# EasyEDA Pro project v1_full_project.epro, board PCB2_3
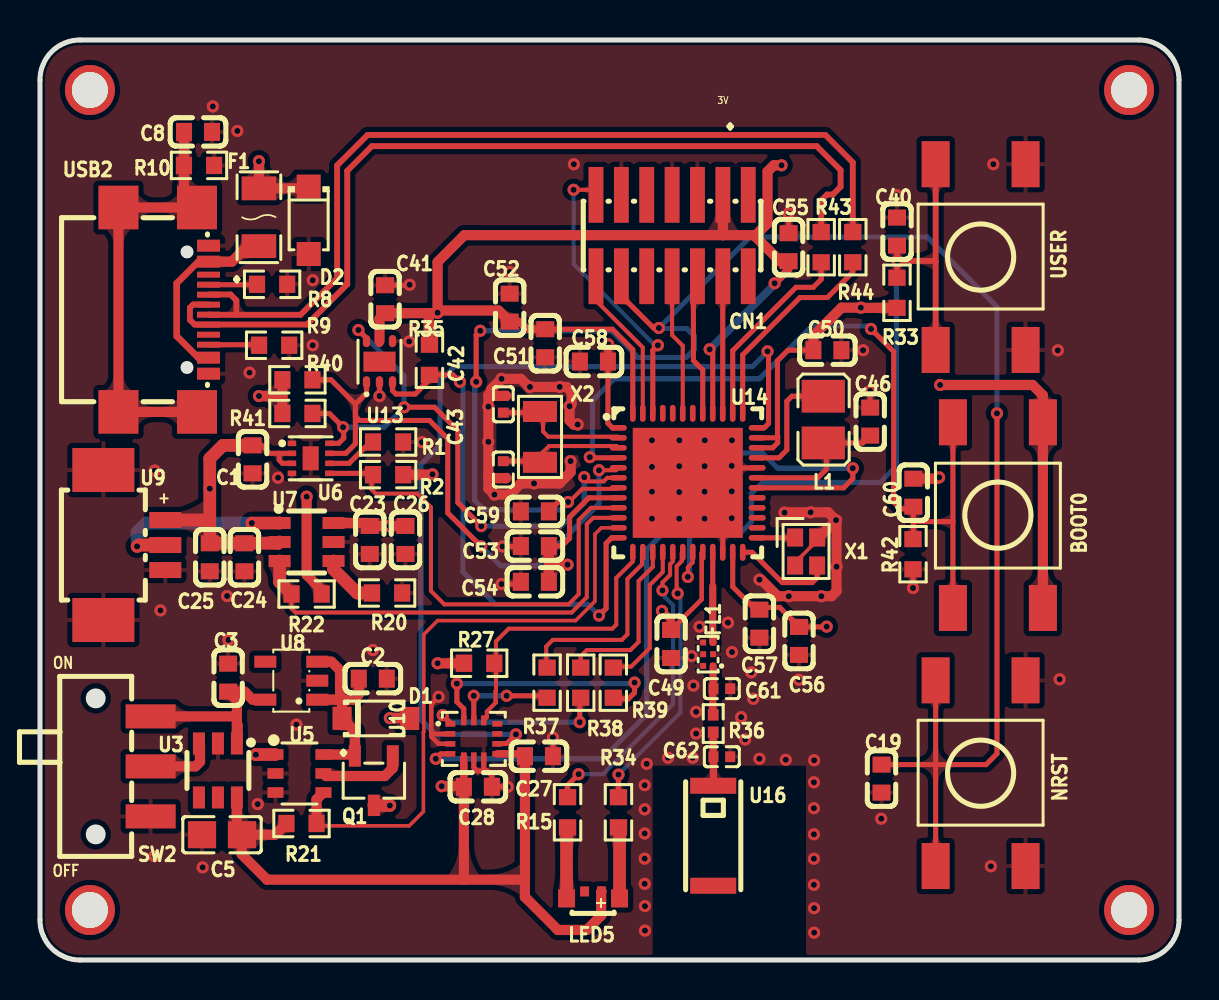
[diagram p1: board, top side]
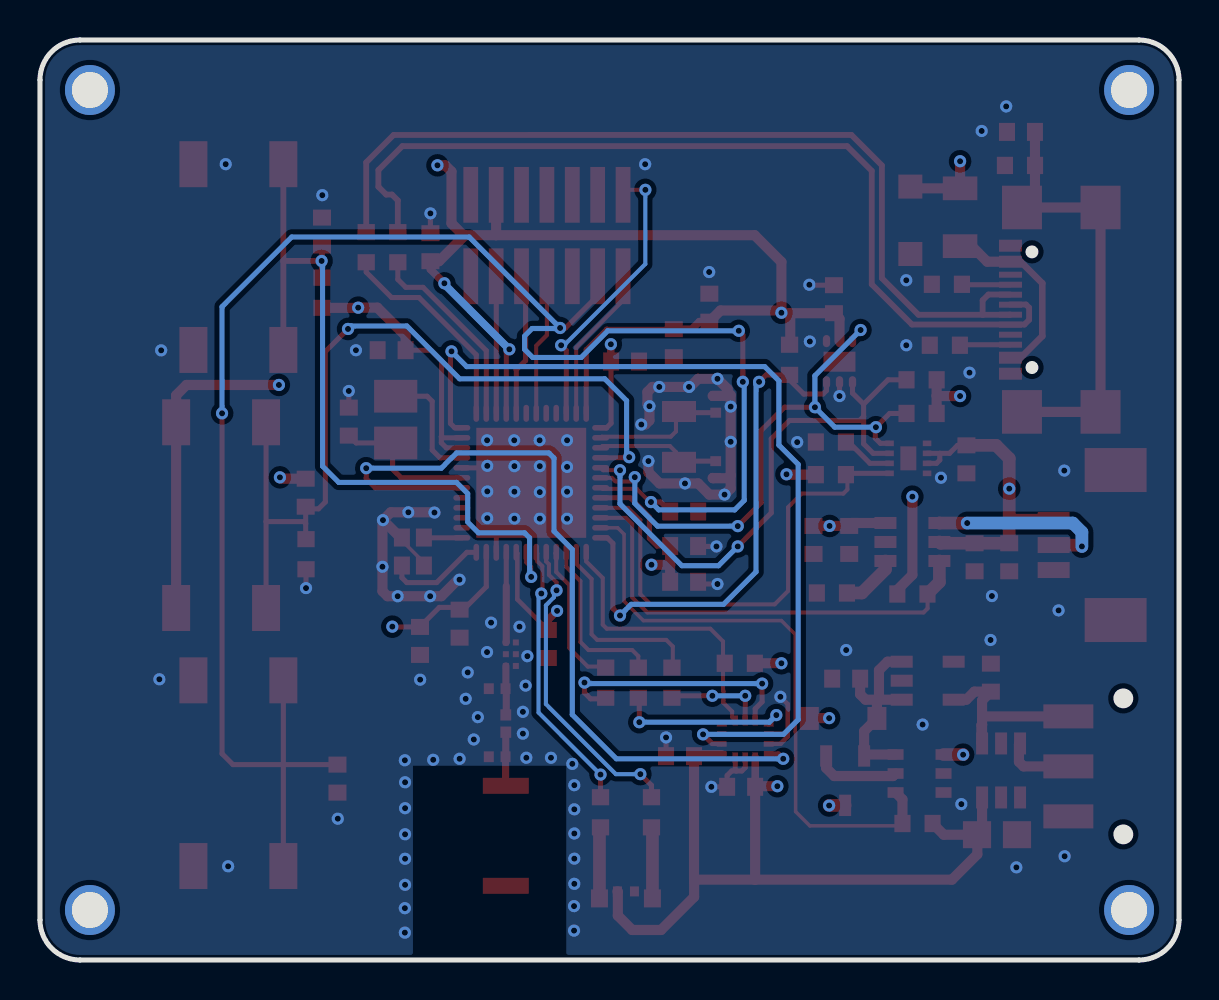
[diagram p2: board, bottom side, seen from below]

Outline 57 x 46 mm; copper layers: Top Layer, GND, POWER, Bottom Layer. Coordinates in mm from the lower left corner of the outline.
Outline path: 0,44 0,2 arc(0.59,0.59) 2,0 55,0 arc(56.41,0.59) 57,2 57,44 arc(56.41,45.41) 55,46 2,46 arc(0.59,45.41) 0,44
Stack: Top Layer 0.035mm 外层铜厚1oz / Dielectric1 0.2104mm 7628 RC49% 8.6mil / GND 0.0152mm 内层铜厚 / Dielectric2 1.065mm 1.1mm H/HOZ Copper / POWER 0.0152mm 内层铜厚 / Dielectric3 0.2104mm 7628 RC49% 8.6mil / Bottom Layer 0.035mm 外层铜厚1oz

## Design rules (mm)
net USBP: DP1
net USBN: DP1
spacing copperThickness1oz (default): track to track 0.102, other pairs 0.102 to 0.3
spacing copperThickness2oz: track to track 0.051, other pairs 0.051 to 0.3
spacing Plane_innerPlane: track to track 0.102, other pairs 0.102 to 0.3
spacing Copper_copperRegion: track to track 0.102, other pairs 0.102 to 0.3
track width copperThickness1oz (default): min 0.089, default 0.254, max 2.54
track width copperThickness2oz: min 0.051, default 0.254, max 2.54
differential pair differentialPair (default): width min 0.127, default 0.292, max 2.54; gap min 0.152, default 0.152
via viaSize (default): diameter min 0.5, default 0.61, max 10; hole min 0.3, default 0.305, max 6.3
net GND uses copperRegion_copperThickness1oz
pour e849 uses Copper_copperRegion, copperRegion_Copper_copperRegion
pour e1013 uses Copper_copperRegion, copperRegion_Copper_copperRegion
pour e1015 uses Copper_copperRegion, copperRegion_Copper_copperRegion
pour e1136 uses Copper_copperRegion, copperRegion_Copper_copperRegion

## Placement (name value [footprint] x y rotation side)
BOOT0  TL3301AF160QG  [KEY-SMD_4P-L6.0-W6.0-P4.50-LS10.0]  47.94 22.24 0 top
C1  100nF  [C0603]  10.64 25.03 90 top
C2  1uF  [C0603]  16.66 14.07 0 top
C3  1uF  [C0603]  9.42 14.12 90 top
C5  47uF  [C0805]  9.11 6.26 180 top
C8  100nF  [C0603]  7.91 41.41 0 top
C19  1uF  [C0603]  42.11 9.07 270 top
C23  4.7uF  [C0603]  16.5 21 270 top
C24  4.7uF  [C0603]  10.23 20.14 270 top
C25  100nF  [C0603]  8.5 20.14 90 top
C26  100nF  [C0603]  18.29 21 90 top
C27  100nF  [C0603]  24.97 10.19 180 top
C28  100nF  [C0603]  21.91 8.66 180 top
C40  1uF  [C0603]  42.89 36.42 90 top
C41  100nF  [C0603]  17.27 33.04 90 top
C42  8.2pF  [C0402]  23.19 27.79 90 top
C43  8.2pF  [C0402]  23.19 24.52 270 top
C46  4.7uF  [C0603]  41.55 26.92 90 top
C49  100nF  [C0603]  31.58 15.8 90 top
C50  100nF  [C0603]  39.4 30.49 0 top
C51  100nF  [C0603]  25.28 30.84 270 top
C52  4.7uF  [C0603]  23.5 32.62 90 top
C53  10nF  [C0603]  24.77 20.7 180 top
C54  1uF  [C0603]  24.77 18.91 180 top
C55  100nF  [C0603]  37.46 35.64 90 top
C56  100nF  [C0603]  37.98 15.95 90 top
C57  100pF  [C0603]  36 16.82 90 top
C58  100nF  [C0603]  27.72 29.92 0 top
C59  100nF  [C0603]  24.77 22.43 180 top
C60  1uF  [C0603]  43.7 23.37 270 top
C61  8.2pF  [C0402]  34.12 13.57 0 top
C62  8.2pF  [C0402]  34.12 10.16 0 top
CN1  FTSH-107-01-L-DV-K  [HDR-SMD_14P-P1.27_FTSH-107-01-L-DV-K]  31.63 36.22 180 top
D1  B5819W-TP  [SOD-123_L2.8-W1.8-LS3.7-RD]  16.81 12.08 0 top
D2  SMF5V0A-E3-08  [SMF_L2.8-W1.8-LS3.7-RD]  13.45 36.98 270 top
F1  MF-NSMF050-2  [F1206]  10.96 37.14 270 top
FL1  MLPF-WB55-02E3  [FILTER-SMD_6P-L1.6-W1.0-P0.50-BL]  33.43 15.29 90 top
L1  2.2uH  [L1008]  39.2 27.02 270 top
LED5  APFA2507B2Y2C  [LED-SMD_4P-L2.5-W1.0_APFA2507LQBDSEEZGKC]  27.68 3.25 180 top
NOREF  -  [Pad_e11400]  2.5 2.5 0 top
NOREF#2  -  [Pad_e10787]  2.5 43.5 0 top
NOREF#3  -  [Pad_e11401]  54.5 43.5 0 top
NOREF#4  -  [Pad_e11402]  54.5 2.5 0 top
NRST  TL3301AF160QG  [KEY-SMD_4P-L6.0-W6.0-P4.50-LS10.0]  47.07 9.34 180 top
Q1  AO3407A  [SOT-23-3_L2.9-W1.6-P1.90-LS2.8-BR]  16.71 8.97 90 top
R1  10kΩ  [R0603]  17.42 25.9 180 top
R2  100kΩ  [R0603]  17.42 24.27 180 top
R8  5.1kΩ  [R0603]  11.62 33.79 180 top
R9  5.1kΩ  [R0603]  11.72 30.74 180 top
R10  10kΩ  [R0603]  7.96 39.73 0 top
R15  4.7kΩ  [R0603]  26.4 7.39 270 top
R20  1.8kΩ  [R0603]  17.37 18.35 0 top
R21  470kΩ  [R0603]  13.09 6.83 180 top
R22  100kΩ  [R0603]  13.34 18.3 0 top
R27  10kΩ  [R0603]  21.98 14.84 180 top
R33  10kΩ  [R0603]  42.89 33.36 270 top
R34  4.7kΩ  [R0603]  28.95 7.39 270 top
R35  5kΩ  [R0603]  19.49 30.01 90 top
R36  0Ω  [R0402]  33.69 11.82 270 top
R37  22Ω  [R0603]  25.38 13.87 90 top
R38  22Ω  [R0603]  27.06 13.87 90 top
R39  22Ω  [R0603]  28.69 13.87 90 top
R40  4.7kΩ  [R0603]  12.88 29.01 0 top
R41  4.7kΩ  [R0603]  12.88 27.33 0 top
R42  10kΩ  [R0603]  43.69 20.29 90 top
R43  22Ω  [R0603]  39.09 35.64 90 top
R44  22Ω  [R0603]  40.67 35.64 90 top
SW2  JS102011SAQN  [SW-SMD_JS102011SAQN]  5.54 9.68 270 top
U3  TPS22917DBVR  [SOT-23-6_L2.9-W1.6-P0.95-LS2.8-BR]  8.9 9.48 90 top
U5  LTC4412ES6#TRPBF  [TSOT-23-6_L2.9-W1.6-P0.95-LS2.8-BR]  12.98 9.32 180 top
U6  MAX17048G+T10  [TDFN-8_L2.0-W2.0-P0.50-BL-EP1.2]  13.55 25.08 270 top
U7  BQ21040DBVT  [SOT-23-6_L2.9-W1.6-P0.95-LS2.8-BR]  13.34 20.9 180 top
U8  TLV75530PDBVR  [SOT-23-5_L3.0-W1.7-P0.95-LS2.8-BR]  12.58 13.97 0 top
U9  532610371  [CONN-TH_532610371]  4.72 20.75 270 top
U10  LSM6DSOXTR  [LGA-14L_L3.0-W2.5-P0.50-TL]  21.71 11.06 0 top
U13  TMP117AIDRVR  [WSON-6_L2.0-W2.0-P0.65-TL-EP]  16.99 29.92 90 top
U14  STM32WB55CCU6  [VQFN-48_L7.0-W7.0-P0.50-BL-EP5.5]  32.42 23.86 270 top
U16  2450AT42A100E  [ANT-SMD_L5.0-W2.0]  33.69 6.21 270 top
USB2  USB4110-GF-A  [USB-C-SMD_TYPE-C-16P-USB4110-GF-A]  6.18 32.52 270 top
USER  TL3301AF160QG  [KEY-SMD_4P-L6.0-W6.0-P4.50-LS10.0]  47.07 35.15 180 top
X1  32MHz  [CRYSTAL-SMD_4P-L2.0-W1.6-BL]  38.34 20.42 270 top
X2  32.768kHz  [CRYSTAL-SMD_L3.2-W1.5-2]  25.02 26.15 90 top

## Footprints (pads in the part's own frame, mm; a bottom-side part is the same pattern mirrored in y, then rotated)
ANT-SMD_L5.0-W2.0
  rect 0.8x2.3 smd: 1(-2.5,0) 2(2.5,0)
C0402
  rect 0.5x0.54 smd: 1(-0.42,0) 2(0.42,0)
C0603
  rect 0.8x0.9 smd: 1(-0.7,0) 2(0.7,0)
C0805
  rect 1.41x1.35 smd: 1(-1,0) 2(1,0)
CONN-TH_532610371
  rect 0.8x1.6 smd: 1(-1.25,1.55) 2(0,1.55) 3(1.25,1.55)
  rect 2.2x3.1 smd: 4(3.75,-1.55) 5(-3.75,-1.55)
CRYSTAL-SMD_4P-L2.0-W1.6-BL
  rect 0.9x0.8 smd: 1(-0.7,-0.55) 2(0.7,-0.55) 3(0.7,0.55) 4(-0.7,0.55)
CRYSTAL-SMD_L3.2-W1.5-2
  rect 1.05x1.7 smd: 1(-1.27,0) 2(1.27,0)
F1206
  rect 1.19x1.728 smd: 1(-1.445,0) 2(1.445,0)
FILTER-SMD_6P-L1.6-W1.0-P0.50-BL
  rect 0.3x0.3 smd: 1(-0.587,-0.25) 2(0,-0.25) 3(0.587,-0.25) 4(0.587,0.25) 5(0,0.25) 6(-0.587,0.25)
HDR-SMD_14P-P1.27_FTSH-107-01-L-DV-K
  rect 0.74x2.79 smd: 01(-3.81,-2.035) 02(-3.81,2.035) 03(-2.54,-2.035) 04(-2.54,2.035) 05(-1.27,-2.035) 06(-1.27,2.035) 07(0,-2.035) 08(0,2.035) 09(1.27,-2.035) 10(1.27,2.035) 11(2.54,-2.035) 12(2.54,2.035) 13(3.81,-2.035) 14(3.81,2.035)
KEY-SMD_4P-L6.0-W6.0-P4.50-LS10.0
  rect 1.4x2.3 smd: 1(-2.25,-4.643) 2(-2.25,4.643) 3(2.25,4.643) 4(2.25,-4.643)
L1008
  rect 1.635x2.16 smd: 1(-1.167,0) 2(1.167,0)
LED-SMD_4P-L2.5-W1.0_APFA2507LQBDSEEZGKC
  rect 0.85x0.9 smd: 1(-1.325,0.175) 4(1.325,0.175)
  rect 0.45x0.5 smd: 2(-0.425,-0.175) 3(0.425,-0.175)
LGA-14L_L3.0-W2.5-P0.50-TL
  rect 0.5x0.28 smd: 1(-1.175,0.75) 2(-1.175,0.25) 3(-1.175,-0.25) 4(-1.175,-0.75) 8(1.175,-0.75) 9(1.175,-0.25) 10(1.175,0.25) 11(1.175,0.75)
  rect 0.28x0.5 smd: 5(-0.5,-0.925) 6(0,-0.925) 7(0.5,-0.925) 12(0.5,0.925) 13(0,0.925) 14(-0.5,0.925)
Pad_e10787
  round 2.5 hole 1.8: 1(0,0)
Pad_e11400
  round 2.5 hole 1.8: 1(0,0)
Pad_e11401
  round 2.5 hole 1.8: 1(0,0)
Pad_e11402
  round 2.5 hole 1.8: 1(0,0)
R0402
  rect 0.566x0.54 smd: 1(-0.433,0) 2(0.433,0)
R0603
  rect 0.806x0.864 smd: 1(-0.753,0) 2(0.753,0)
SMF_L2.8-W1.8-LS3.7-RD
  rect 1.2x1.2 smd: 1(-1.685,0) 2(1.685,0)
SOD-123_L2.8-W1.8-LS3.7-RD
  rect 0.95x1.15 smd: 1(-1.692,0) 2(1.692,0)
SOT-23-3_L2.9-W1.6-P1.90-LS2.8-BR
  rect 1.07x0.6 smd: 1(1.235,-0.95) 2(1.235,0.95) 3(-1.235,0)
SOT-23-5_L3.0-W1.7-P0.95-LS2.8-BR
  rect 1.1x0.6 smd: 1(1.3,-0.95) 2(1.3,0) 3(1.3,0.95) 4(-1.3,0.95) 5(-1.3,-0.95)
SOT-23-6_L2.9-W1.6-P0.95-LS2.8-BR
  rect 1.1x0.6 smd: 1(1.35,-0.95) 2(1.35,0) 3(1.35,0.95) 4(-1.35,0.95) 5(-1.35,0) 6(-1.35,-0.95)
SW-SMD_JS102011SAQN
  rect 1.2x2.5 smd: 1(-2.5,0) 2(0,0) 3(2.5,0)
TDFN-8_L2.0-W2.0-P0.50-BL-EP1.2
  rect 0.28x0.425 smd: 1(-0.75,-0.938) 2(-0.25,-0.938) 3(0.25,-0.938) 4(0.75,-0.938) 5(0.75,0.938) 6(0.25,0.938) 7(-0.25,0.938) 8(-0.75,0.938)
  rect 1.2x0.8 smd: 9(0,0)
TSOT-23-6_L2.9-W1.6-P0.95-LS2.8-BR
  rect 0.8x0.532 smd: 1(1.2,-0.95) 2(1.2,0) 3(1.2,0.95) 4(-1.2,0.95) 5(-1.2,0) 6(-1.2,-0.95)
USB-C-SMD_TYPE-C-16P-USB4110-GF-A
  rect 2.18x2 smd: 8(-5.11,1.677) 9(5.11,1.677) 10(-5.11,-2.252) 11(5.11,-2.252)
  rect 0.6x1.15 smd: A1B12(-3.2,2.252) A4B9(-2.4,2.252) B1A12(3.2,2.252) B4A9(2.4,2.252)
  rect 0.3x1.15 smd: A5(-1.25,2.252) A6(-0.25,2.252) A7(0.25,2.252) A8(1.25,2.252) B5(1.75,2.252) B6(0.75,2.252) B7(-0.75,2.252) B8(-1.75,2.252)
VQFN-48_L7.0-W7.0-P0.50-BL-EP5.5
  oval 0.28x0.85 smd: 1(-2.75,-3.474) 2(-2.25,-3.474) 3(-1.75,-3.474) 4(-1.25,-3.474) 5(-0.75,-3.474) 6(-0.25,-3.474) 7(0.25,-3.474) 8(0.75,-3.474) 9(1.25,-3.474) 10(1.75,-3.474) 11(2.25,-3.474) 12(2.75,-3.474) 25(2.75,3.474) 26(2.25,3.474) 27(1.75,3.474) 28(1.25,3.474) 29(0.75,3.474) 30(0.25,3.474) 31(-0.25,3.474) 32(-0.75,3.474) 33(-1.25,3.474) 34(-1.75,3.474) 35(-2.25,3.474) 36(-2.75,3.474)
  oval 0.85x0.28 smd: 13(3.474,-2.75) 14(3.474,-2.25) 15(3.474,-1.75) 16(3.474,-1.25) 17(3.474,-0.75) 18(3.474,-0.25) 19(3.474,0.25) 20(3.474,0.75) 21(3.474,1.25) 22(3.474,1.75) 23(3.474,2.25) 24(3.474,2.75) 37(-3.474,2.75) 38(-3.474,2.25) 39(-3.474,1.75) 40(-3.474,1.25) 41(-3.474,0.75) 42(-3.474,0.25) 43(-3.474,-0.25) 44(-3.474,-0.75) 45(-3.474,-1.25) 46(-3.474,-1.75) 47(-3.474,-2.25) 48(-3.474,-2.75)
  rect 5.5x5.5 smd: 49(0,0)
WSON-6_L2.0-W2.0-P0.65-TL-EP
  oval 0.607x0.364 smd: 1(-1.028,0.65) 2(-1.028,0) 3(-1.028,-0.65) 4(1.028,-0.65) 5(1.028,0) 6(1.028,0.65)
  rect 1x1.6 smd: 7(0,0)

## Nets
As in the schematic, except:
3V: BOOT0.3 BOOT0.4 C5.1 C27.2 C28.2 C41.1 C49.2 C50.1 C51.1 C52.1 C53.1 C54.1 C55.1 C56.2 C57.2 C58.2 C60.1 CN1.03 LED5.2 R2.1 R21.2 R22.2 R27.2 R33.2 R35.2 R40.1 R41.1 U3.6 U10.5 U10.8 U13.5 U14.1 U14.8 U14.20 U14.23 U14.34 U14.35 U14.40 U14.48
GND: C1.1 C2.2 C3.2 C5.2 C8.2 C19.2 C23.2 C24.2 C25.1 C26.1 C27.1 C28.1 C40.2 C41.2 C42.2 C43.2 C46.2 C49.1 C50.2 C51.2 C52.2 C53.2 C54.2 C55.2 C56.1 C57.1 C58.1 C59.2 C61.2 C62.2 CN1.05 CN1.07 CN1.11 D2.2 FL1.2 FL1.4 FL1.5 FL1.6 NRST.1 NRST.2 R1.1 R8.1 R9.1 R10.2 R20.2 R42.1 SW2.3 U3.2 U5.2 U5.3 U6.1 U6.4 U6.9 U7.5 U8.2 U9.3 U9.4 U9.5 U10.2 U10.3 U10.6 U10.7 U13.2 U13.4 U14.22 U14.32 U14.49 USB2.A1B12 USB2.B1A12 USER.1 USER.2 X1.2 X1.4
BOOT0: BOOT0.1 BOOT0.2 C60.2 R42.2 U14.4
LED_GREEN: R15.1 U14.17
LED_RED: R34.1 U14.18
NRST: C19.1 C59.1 CN1.12 NRST.3 NRST.4 U14.7
USER: C40.1 R33.1 U14.19 USER.3 USER.4
$1N27694: LED5.4 R15.2
$1N27696: LED5.1 R34.2

Pads without a net: CN1 01 02 09 10; LED5 3; NOREF 1; NOREF#2 1; NOREF#3 1; NOREF#4 1; U3 4 5; U8 4; U10 10 11; U13 7; U14 26 27 28 29 42 44 45; U16 2; USB2 A8 B8

## Via types
v1: diameter 0.61, hole 0.305, Top Layer to Bottom Layer, 159 vias

## Routing (per net, layer and track width the routed paths; a pad name or vN(x,y) marks a point on that pad's centre or on a via; arc(x,y) is an arc through that point)
3V: length 269.4
  Top Layer w0.229: U14.20 33.11,20.33 33.11,18.03 C49.2
  Top Layer w0.254: 36.92,26.17 36.85,26.11 U14.35 ; 36.92,26.17 36.92,25.86 36.66,25.61 U14.34 ; 36.92,26.17 36.9,26.19 36.9,29.96 37.43,30.49 C50.1 ; U14.8 27.46,23.11 26.5,22.15 26.5,21.09 26.11,20.7 25.47,20.7 ; C51.1 28.65,31.54 29.67,30.52 U14.48 ; C58.2 28.42,26.84 28.65,26.61 U14.1 ; v1(39.37,16.67) 39.35,16.65 37.99,16.65 37.02,17.63 35.7,17.63 34.67,18.66 U14.23 ; U14.40 33.67,30.38 v1(33.51,30.53)
  Top Layer w0.381: v1(36.76,33.84) 37.46,34.53 C55.1 ; 21.21,8.66 U10.5 ; C58.2 28.43,29.94 v1(28.43,30.79) ; C51.1 24.38,31.54 24,31.92 C52.1 ; C27.2 24.15,10.31 U10.8 ; C49.2 31.58,17 v1(31.12,17.46)
  Top Layer w0.508: C60.1 44.92,24.06 v1(44.99,24.13) ; 19.45,32.34 C41.1 16.99,32.06 U13.5 ; 19.45,32.34 19.45,30.8 R35.2 ; 19.45,32.34 19.87,32.34 v1(19.9,32.36) ; 21.21,4.02 11.36,4.02 10.09,5.29 10.09,6.25 C5.1 ; 21.21,4.02 C28.2 ; 21.21,4.02 24.22,4.02 ; v1(19.9,32.36) 20.01,32.48 22.95,32.48 C52.1 ; v1(19.9,32.36) 19.9,34.9 21.24,36.24 34.18,36.24 ; v1(20.1,8.69) 21.18,8.69 21.21,8.66 ; v1(37.11,39.73) 36.72,39.73 36.41,39.42 36.41,36.83 35.81,36.24 35.73,36.24 ; U3.6 9.86,6.52 C5.1 ; v1(26.4,19.76) 25.47,19.76 ; 25.47,19.76 25.47,20.7 ; 25.47,19.76 C54.1 ; C27.2 24.27,4.06 24.22,4.02 ; C5.1 11.77,6.26 R21.2 ; 24.22,4.02 24.27,3.97 24.27,3.15 25.92,1.5 27.36,1.5 28.08,2.22 28.08,3.41 LED5.2 ; R27.2 v1(19.9,14.84) ; 12.13,28.21 12.13,27.33 ; 12.13,28.21 12.13,29.01 ; 12.13,28.21 12.12,28.2 v1(10.96,28.2) ; v1(13.34,23.17) 13.34,19.26 14.1,18.51 R22.2 ; v1(19.64,24.29) 19.62,24.27 18.07,24.27 ; 34.18,36.24 34.17,36.25 34.17,38.26 ; 34.18,36.24 35.73,36.24 ; 37.36,34.94 37.03,34.94 35.73,36.24 ; R33.2 41.09,32.61 v1(41.08,32.62) 40.11,32.62 38.7,31.21 C50.1 ; v1(45.04,28.75) 49.67,28.75 50.19,28.24 BOOT0.3 BOOT0.4
  POWER w0.381: v1(31.12,17.46) 32.05,17.46 33.07,18.48 33.07,21 33.56,21.49 34.22,21.49 34.73,20.98 34.73,18.33 36.39,16.67 v1(39.37,16.67)
  POWER w0.508: v1(20.1,8.69) 19.34,8.69 18.83,9.2 18.83,14.84 ; v1(39.37,16.67) 43.61,16.67 44.99,18.05 v1(44.99,24.13) 45.04,24.18 v1(45.04,28.75) 45.04,31.55 43.98,32.62 v1(41.08,32.62) 41.08,39.07 40.41,39.73 v1(37.11,39.73) ; 18.83,14.84 18.83,23.17 ; 18.83,14.84 v1(19.9,14.84) ; 18.83,19.71 18.88,19.76 v1(26.4,19.76) ; 19.9,30.75 28.39,30.75 v1(28.43,30.79) ; 19.9,30.75 v1(19.9,32.36) ; 19.9,30.75 19.9,24.54 v1(19.64,24.29) 19.64,23.42 19.39,23.17 18.83,23.17 ; v1(10.96,28.2) 13.34,25.81 v1(13.34,23.17) 18.83,23.17
  Bottom Layer w0.381: v1(36.76,33.84) 36.76,33.79 v1(33.51,30.53)
GND: length 55.8
  Top Layer w0.178: X1.2 37.79,19.87 38.89,20.97 38.89,21.12
  Top Layer w0.229: 19.58,11.31 20.53,11.31 ; 19.58,11.31 19.58,12.79 v1(19.95,13.16) ; 19.58,11.31 19.58,11.17 19.94,10.81 20.53,10.81 20.53,10.81
  Top Layer w0.254: R42.1 v1(43.69,18.6) ; C54.2 23.95,18.8 v1(23.1,18.8) ; v1(18.5,33.76) 18.48,33.74 C41.2 ; U14.32 35.89,24.61 33.34,24.61 v1(33.26,24.69) 32.43,23.86 U14.49 34.17,22.11 U14.22 ; 24.07,20.7 24.05,20.68 v1(23.15,20.68) ; 37.36,36.34 37.46,36.44 v1(37.46,37.33) ; 25.67,10.19 v1(25.67,11.13) ; 22.15,9.45 22.39,9.45 22.61,9.22 C28.1 v1(23.4,8.66) ; 22.15,9.45 21.88,9.45 21.71,9.62 U10.6 ; 22.15,9.45 22.21,9.51 U10.7 ; C46.2 v1(41.55,28.45) ; U13.2 v1(16.99,28.2)
  Top Layer w0.508: v1(39.84,21.99) 39.44,22.38 v1(38.57,22.38) 37.27,22.38 v1(37.26,22.37) ; v1(39.84,21.99) 39.86,21.97 v1(39.86,19.66) 39.86,18.44 39.61,18.19 v1(39.1,18.19) v1(37.47,18.19) 36.92,18.19 36.09,19.02 v1(36.01,19.02) ; v1(39.84,21.99) 38.97,21.12 38.89,21.12 ; 22.44,24.24 v1(22.44,25.91) v1(22.44,27.67) 22.44,28.25 22.59,28.4 ; 22.44,24.24 22.59,24.09 23.32,24.09 23.34,24.1 ; 22.44,24.24 22.44,23.57 v1(22.74,23.27) 23.5,23.27 24.06,23.83 v1(24.72,23.83) 25.99,23.83 26.55,24.39 v1(26.55,24.95) ; 22.59,28.4 22.59,28.55 v1(23.1,29.06) 24.06,29.06 24.47,28.65 v1(24.52,28.65) v1(26.01,28.65) 26.35,28.65 26.6,28.4 26.6,27.79 v1(26.5,27.69) 26.5,26.98 26.7,26.77 v1(26.91,26.77) ; 22.59,28.4 22.78,28.21 23.34,28.21
  vias: v1(5.74,24.47) v1(5.72,5.19) v1(6.03,17.48) v1(8.14,4.63) v1(8.65,42.68) v1(9.36,18.2) v1(9.43,16) v1(9.88,41.45) v1(10.49,29.37) v1(10.89,7.79) v1(11.91,24.11) v1(12.83,11.77) v1(13.65,33.99) v1(13.65,30.74) v1(16.66,15.5) v1(18.48,30.93) v1(19.11,25.89) v1(23.51,34.4) v1(26.72,39.79) v1(30.26,8.74) v1(30.26,7.53) v1(30.26,6.33) v1(30.26,5.07) v1(30.26,3.81) v1(30.27,2.69) v1(30.27,1.47) v1(30.36,9.81) v1(30.62,25.99) v1(30.62,24.66) v1(30.62,23.41) v1(30.62,22.07) v1(31.43,10.11) v1(31.99,24.69) v1(31.99,23.39) v1(31.99,22.07) v1(32,25.99) v1(32.61,15.19) v1(32.66,10.11) v1(32.7,13.72) v1(32.83,12.41) v1(32.83,11.32) v1(33,16.67) v1(33.27,25.99) v1(33.26,23.42) v1(33.26,22.07) v1(34.43,16.87) v1(34.63,25.99) v1(34.62,24.71) v1(34.62,23.43) v1(34.62,22.09) v1(34.63,15.4) v1(35.09,12.14) v1(35.29,11.03) v1(35.59,14.38) v1(35.7,13.06) v1(36,10.06) v1(37.32,10.01) v1(37.98,14.02) v1(38.74,9.99) v1(38.73,8.89) v1(38.73,7.59) v1(38.73,6.29) v1(38.73,5.06) v1(38.73,3.76) v1(38.74,2.59) v1(38.74,1.37) v1(41.19,30.49) v1(42.1,7.07) v1(42.87,38.24) v1(47.58,4.69) v1(47.71,39.79) v1(50.93,30.48) v1(51.03,14.04)
VBUS: length 43.2
  Top Layer w0.508: C26.2 v1(17.49,21.7) C23.1 16.36,21.85 U7.6 ; D1.2 18.49,12.09 v1(17.51,12.09) ; 13.34,38.67 13.26,38.58 11.01,38.58 10.96,38.63 v1(10.96,39.94)
  POWER w0.508: v1(10.96,39.94) 9.53,38.52 9.53,25.1 12.33,22.3 16.89,22.3 v1(17.49,21.7) 17.52,21.68 17.52,21.67 18.02,21.16 18.02,12.61 v1(17.51,12.09)
VBUS_RAW: length 9.6
  Top Layer w0.33: USB2.B4A9 7.92,30.12 6.84,31.19 6.84,33.84 7.92,34.92 USB2.A4B9
  Top Layer w0.508: USB2.A4B9 9.6,34.92 10.38,35.69 11.01,35.69
ALRT: length 24.2
  Top Layer w0.203: U14.9 27.57,22.61 26.96,22 26.96,18.29 26.45,17.78 20.23,17.78 19.56,18.45 19.56,22.64 18.88,23.32 16.8,23.32 16.6,23.52 16.6,24.24 16.57,24.27
  Top Layer w0.254: U6.5 16.5,24.33 16.57,24.27
BAT+: length 39.4
  Top Layer w0.254: U6.3 12.14,24.83 11.97,25 11.97,25.33 ; 11.97,25.33 U6.2 ; 11.97,25.33 11.48,25.33 11.08,25.73 10.64,25.73
  Top Layer w0.635: v1(10.8,10.26) 10.81,10.27 U5.1 ; 8.5,22 8.5,20.84 11.93,20.84 U7.2 ; 8.5,22 U9.1 ; 8.5,22 v1(8.5,23.57) 8.5,25.08 9.15,25.73 10.64,25.73 ; v1(17.51,7.72) 17.5,7.73 Q1.3
  POWER w0.635: v1(8.5,23.57) 8.5,12.57 v1(10.8,10.26) 14.97,10.26 v1(17.51,7.72)
BOOT0: length 43.1
  Top Layer w0.254: 43.7,21.82 C60.2 43.6,22.56 43.06,22.56 42.72,22.9 42.72,30.42 v1(41.59,31.55) ; 43.7,21.82 43.8,21.92 45.69,21.92 ; 43.7,21.82 43.7,21.06 R42.2 ; U14.4 27.55,25.11 v1(27.52,25.14) ; 45.69,21.92 BOOT0.2 ; 45.69,21.92 BOOT0.1
  Bottom Layer w0.254: v1(27.52,25.14) 27.64,25.27 27.64,27.97 28.74,29.06 36,29.06 38.64,31.7 41.44,31.7 v1(41.59,31.55)
CHG: length 23.2
  Top Layer w0.203: R22.1 12.58,18.29 12.58,17.58 12.79,17.38 26.6,17.38 27.36,18.14 27.36,21.8 27.68,22.11 U14.10
  Top Layer w0.635: U7.3 11.99,18.9 R22.1
HSE_IN: length 1.9
  Top Layer w0.254: X1.1 37.77,21.11 U14.25
HSE_OUT: length 5.1
  Top Layer w0.254: 38.89,19.72 38.89,19.12 38.64,18.87 37.15,18.87 35.64,20.38 U14.24
I2C_SCL: length 28.9
  Top Layer w0.203: U14.5 28.82,24.49 v1(27.97,24.49)
  Top Layer w0.254: 15.78,27.18 15.78,25.81 15.31,25.33 U6.7 ; 15.78,27.18 15.78,27.79 ; 15.78,27.18 15.98,26.98 19.49,26.98 20.41,26.06 20.41,22.36 v1(22.08,20.68) ; 15.78,27.79 16.34,28.35 U13.1 ; 15.78,27.79 14.56,29.01 R40.2
  Bottom Layer w0.254: v1(22.08,20.68) 23.05,19.71 24.88,19.71 27.97,22.81 v1(27.97,24.49)
I2C_SDA: length 29.5
  Top Layer w0.203: U14.6 28.39,24.11 28.21,23.93 27.36,23.93 27.23,24.05 v1(27.23,24.14)
  Top Layer w0.254: U13.6 16.34,31.09 v1(15.93,31.5) ; R41.2 14.48,27.33 v1(15.17,26.64) 15.2,26.61 15.2,26.09 14.95,25.83 U6.8 ; v1(22.08,21.69) 20.91,22.86 20.91,26.47 19.74,27.64 v1(18.22,27.64)
  Bottom Layer w0.254: v1(22.08,21.69) 26.09,21.69 27.23,22.83 v1(27.23,24.14) ; v1(15.93,31.5) 18.22,29.21 v1(18.22,27.64) 17.22,26.64 v1(15.17,26.64)
IMU_INT1: length 40.8
  Top Layer w0.254: v1(19.81,10.06) 20.05,10.31 20.53,10.31 ; U14.30 40.21,23.61 40.67,24.07 v1(40.67,24.59)
  Bottom Layer w0.254: v1(19.81,10.06) 28.16,10.06 30.36,12.27 30.36,20.53 31.28,21.44 31.28,25.1 31.53,25.35 36.15,25.35 36.92,24.59 v1(40.67,24.59)
IMU_INT2: length 44.8
  Top Layer w0.254: U14.36 36.24,26.61 36.46,26.83 36.46,30.38 v1(36.41,30.43) ; v1(23.82,11.28) 23.36,10.82 22.9,10.82 U10.9
  Bottom Layer w0.254: v1(23.82,11.28) 19.8,11.28 19.06,12.02 19.06,24.78 20.02,25.75 20.02,28.96 20.73,29.67 35.65,29.67 v1(36.41,30.43)
LED_GREEN: length 15.6
  Top Layer w0.203: v1(31.15,18.48) 31.15,18.88 31.53,19.26 31.53,19.79 31.67,19.93 31.67,20.38 U14.17
  Top Layer w0.254: R15.1 26.4,8.74 v1(26.96,9.29)
  Bottom Layer w0.203: v1(31.15,18.48) 31.25,18.48 31.28,18.46 31.28,18.14 31.68,17.73 31.68,12.8 28.18,9.29 v1(26.96,9.29)
LED_RED: length 13.8
  Top Layer w0.203: U14.18 32.12,20.33 32.12,19.94 31.86,19.69 31.86,18.38 v1(31.91,18.33)
  Top Layer w0.254: R34.1 v1(28.95,9.27)
  Bottom Layer w0.203: v1(28.95,9.27) 32.05,12.37 32.05,18.25 31.97,18.33 v1(31.91,18.33)
LSE_IN: length 6.8
  Top Layer w0.203: 25.17,27.42 25.17,26.43 25.43,26.17 28.88,26.17 U14.2
  Top Layer w0.254: 23.34,27.37 25.12,27.37 25.17,27.42
LSE_OUT: length 6.3
  Top Layer w0.203: U14.3 28.85,25.7 25.48,25.7 25.17,25.4 25.17,24.88
  Top Layer w0.254: 25.17,24.88 25.12,24.94 23.34,24.94
NRST: length 93.1
  Top Layer w0.203: U14.7 28.89,23.61 28.84,23.56 27.14,23.56 26.53,22.95 26.48,22.95 v1(26.42,22.9)
  Top Layer w0.254: v1(30.97,31.6) 30.7,31.6 28.91,33.4 28.91,34.2 ; 44.82,9.77 47.34,9.77 47.89,10.31 v1(47.89,27.33) ; 44.82,9.77 C19.1 ; 44.82,9.77 NRST.3 ; 44.82,9.77 NRST.4 ; v1(21.83,28.91) 21.83,31.26 v1(22.03,31.46) ; v1(26.42,22.9) 25.93,22.9 C59.1
  Bottom Layer w0.254: v1(47.89,27.33) 47.89,32.66 44.4,36.15 35.52,36.15 v1(30.97,31.6) 31,31.58 32.37,31.58 32.75,31.19 32.75,30.53 32.34,30.13 29.92,30.13 28.58,31.46 v1(22.03,31.46) ; v1(26.42,22.9) 26.03,22.51 22.23,22.51 21.76,22.98 21.76,28.84 v1(21.83,28.91)
RF: length 4.5
  Top Layer w0.254: U14.21 33.67,18.7
  Top Layer w0.355: FL1.3 33.67,15.9 33.67,18.7
SENSOREARTH: length 22.1
  Top Layer w0.508: C8.1 7.21,38.28 USB2.8 USB2.10 USB2.11 USB2.9
SPI_MISO: length 9
  Top Layer w0.254: v1(27.01,11.89) 27.01,13.22 27.06,13.27 ; 20.53,11.81 20.53,11.86 v1(20.15,12.25)
  Bottom Layer w0.254: v1(27.01,11.89) 20.51,11.89 v1(20.15,12.25)
SPI_MOSI: length 12.7
  Top Layer w0.254: 28.69,13.27 28.9,13.06 29.45,13.06 29.75,13.36 v1(29.75,13.87) ; U10.14 21.21,12.56 20.86,12.91 v1(20.86,13.82)
  Bottom Layer w0.254: v1(20.86,13.82) 29.7,13.82 v1(29.75,13.87)
SPI_NSS0: length 14.5
  Top Layer w0.203: U10.12 22.36,12.13 22.36,12.42 22.82,12.88 22.82,12.95 22.79,12.98 22.79,13.44 22.82,13.47 22.82,15.93 23.45,16.56 28.64,16.56 28.84,16.77 28.84,19.1 29.67,19.93 U14.13
SPI_SCK: length 4.9
  Top Layer w0.254: 25.38,13.27 25.32,13.21 v1(23.35,13.21) ; U10.13 v1(21.71,13.21)
  Bottom Layer w0.254: v1(21.71,13.21) v1(23.35,13.21)
STAT: length 30.2
  Top Layer w0.178: R21.1 13.96,6.71 18.47,6.71 19.19,7.42 19.19,11.39 19.21,11.41 19.21,16.28 19.9,16.97 26.81,16.97 27.77,17.94 27.77,21.29 28.09,21.61 U14.11
  Top Layer w0.508: R21.1 13.84,8.03 14.18,8.37
SWCLK: length 7.1
  Top Layer w0.254: CN1.06 32.7,33.98 32.7,29.98 33.17,29.51 U14.41
SWDIO: length 6.9
  Top Layer w0.254: U14.39 34.17,34.02 33.99,34.2
SWO: length 7.1
  Top Layer w0.203: CN1.08 31.63,31.25 32.17,30.71 U14.43
TEMP_INT: length 26.3
  Top Layer w0.254: v1(21.02,28.91) 20.67,29.26 R35.1 19.49,29.01 18.78,28.3 17.81,28.3 17.64,28.47 U13.3 ; v1(27.97,17.22) 28.33,17.58 28.33,20.83 28.61,21.11 U14.12
  Bottom Layer w0.254: v1(21.02,28.91) 21.17,28.76 21.17,19.41 22.79,17.78 27.42,17.78 v1(27.97,17.22)
TS: length 9.5
  Top Layer w0.635: v1(10.6,21.85) 11.99,21.85 U7.1 ; U9.2 4.93,20.75 v1(4.86,20.68)
  Bottom Layer w0.635: v1(4.86,20.68) 4.86,21.39 5.32,21.85 v1(10.6,21.85)
USART1_RX: length 7.8
  Top Layer w0.203: U14.47 30.17,30.63 27.82,32.97 CN1.14
USART1_TX: length 14.3
  Top Layer w0.203: v1(26.7,38.51) 27.57,38.51 27.82,38.26
  Top Layer w0.254: U14.46 30.67,30.48 v1(30.92,30.74)
  Bottom Layer w0.203: v1(26.7,38.51) 26.7,34.8 30.77,30.74 v1(30.92,30.74)
USBN: length 45.5
  Top Layer w0.292: 9.83,32.26 9.83,32.98 9.54,33.27 8.46,33.27 ; 9.83,32.26 8.47,32.26 8.46,32.27 ; 9.83,32.26 13.04,32.26 14.87,34.09 14.87,39.73 16.39,41.25 39.3,41.25 40.67,39.88 R44.2
USBP: length 45.5
  Top Layer w0.292: 8.46,32.77 7.66,32.77 7.5,32.62 7.5,32.01 7.74,31.77 13.36,31.77 15.38,33.79 15.38,39.46 16.61,40.69 38.87,40.69 40.06,39.49 40.06,38.66 39.68,38.27 39.39,38.27 39.09,37.98 R43.2
USER: length 39.1
  Top Layer w0.203: v1(32.42,19.15) 32.42,19.64 32.67,19.88 U14.19
  Top Layer w0.292: USER.4 44.82,34.93 ; 44.82,34.93 USER.3 ; 44.82,34.93 44.8,34.95 v1(42.91,34.95) ; R33.1 C40.1
  Bottom Layer w0.254: v1(32.42,19.15) 32.5,19.23 32.5,21.11 32.75,21.36 35.06,21.36 35.59,21.9 35.59,23.32 36.15,23.88 42.05,23.88 42.86,24.69 42.86,34.91 v1(42.91,34.95)
$1N1907: length 10.1
  Top Layer w0.508: 9.86,12.18 9.86,12.98 C3.1 10.24,13.42 10.64,13.02 U8.5 ; 9.86,12.18 9.86,11.77 ; 9.86,12.18 SW2.1 ; 9.86,11.77 U3.1 9.89,10.86 9.89,11.74 9.86,11.77
$1N1916: length 10.5
  Top Layer w0.508: 15.12,13.02 D1.1 15.76,11.44 Q1.2 15.69,10.27 U5.6 ; 15.12,13.02 15.69,13.02 15.96,13.28 C2.1 ; 15.12,13.02 U8.1 ; 15.12,13.02 15.02,13.12 15.02,14.49 14.59,14.92 U8.3
$1N1943: length 4.3
  Top Layer w0.508: U5.5 14.31,9.2 17.26,9.2 17.66,9.6 17.66,10.2 17.66,10.2
$1N1972: length 3.5
  Top Layer w0.508: SW2.2 7.78,9.68 8.01,9.91 8.01,10.77 U3.3
$1N1995: length 2.5
  Top Layer w0.254: U6.6 15.47,24.83 16.53,25.9 16.57,25.9
$1N5876: length 2.8
  Top Layer w0.635: U7.4 14.69,19.53 15.87,18.35 R20.1
$1N23961: length 2.5
  Top Layer w0.355: FL1.1 33.68,13.54 33.65,13.51 33.66,13.49 33.66,12.28 R36.1
$1N23966: length 2.7
  Top Layer w0.355: R36.2 33.69,10.1 33.7,10.09 33.7,8.72 U16.1
$1N24267: length 7.5
  Top Layer w0.254: C46.1 41.18,25.85 L1.2 39.35,25.7 39.35,24.54 38.92,24.11 U14.31
$1N24361: length 6
  Top Layer w0.254: L1.1 37.63,28.19 37.37,27.93 37.37,25.5 36.98,25.11 U14.33
$1N25125: length 9.9
  Top Layer w0.254: R43.1 39.09,34.03 38.69,33.63 37.83,33.63 34.67,30.47 U14.38
$1N25129: length 10.6
  Top Layer w0.254: R44.1 40.67,34.39 39.4,33.12 38.03,33.12 35.17,30.26 U14.37
$1N25174: length 9.7
  Top Layer w0.203: 25.38,14.77 25.38,14.85 25.33,14.89 25.33,15.68 25.66,16.01 29.12,16.01 29.4,16.29 29.4,19.05 30.12,19.78 30.12,20.34 U14.14
$1N25242: length 8.4
  Top Layer w0.203: U14.15 30.67,19.66 29.96,18.95 29.96,15.9 29.55,15.5 27.36,15.5 27.06,15.19 27.06,14.77
$1N25246: length 7.4
  Top Layer w0.203: 31.22,20.33 U14.16 31.17,19.4 30.52,18.75 30.52,15.6 29.59,14.67 28.79,14.67 28.69,14.77
$1N27694: length 3.6
  Top Layer w0.635: 26.45,6.63 26.35,6.53 26.35,3.08
$1N27696: length 3.6
  Top Layer w0.635: LED5.1 29,6.63
$1N40093: length 2.4
  Top Layer w0.254: R8.2 10.84,33.76 USB2.A5
$1N40095: length 2.5
  Top Layer w0.254: USB2.B5 10.94,30.76 R9.2

## Copper pours and planes (outline as drawn; the poured copper is in the pictures)
GND on Top Layer: -2.04,47.77 58.09,47.77 58.09,-2.33 -2.04,-2.33
GND on Bottom Layer: -24.61,58.98 78.92,58.98 78.92,-12.24 -24.61,-12.24
GND on GND: -13.28,50.29 63.38,50.29 63.38,-6.2 -13.28,-6.2
GND on POWER: -8.76,49.39 58.35,49.39 58.35,-3.71 -8.76,-3.71

Small or netless copper shapes (teardrops, artwork), in the pictures only: 288 on Top Layer, 31 on Bottom Layer, 27 on POWER

## Text on the board
Top Silkscreen Layer: 3V | OFF | ON | + | .
